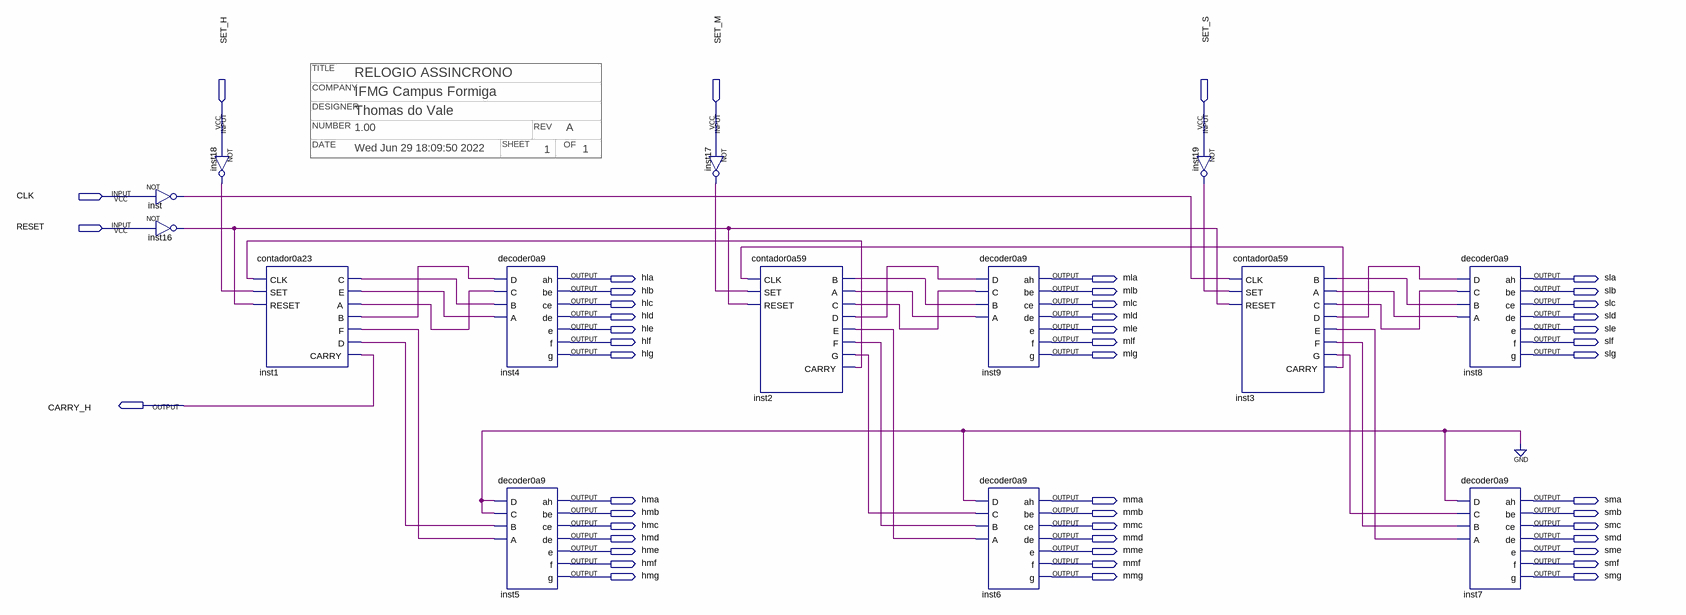
[diagram p0: schematic sheet]
// Quartus schematic tentativa2.bdf as structural Verilog: 14 symbols, 48 pins
// Title block: COMPANY: IFMG Campus Formiga; DATE: Wed Jun 29 18:09:50 2022; DESIGNER: Thomas do Vale; NUMBER: 1.00; OF: 1; REV: A; SHEET: 1; TITLE: RELOGIO ASSINCRONO
module tentativa2 (
  input  SET_H,
  input  SET_M,
  input  SET_S,
  input  CLK,
  input  RESET,
  output hla,
  output mla,
  output sla,
  output hlb,
  output mlb,
  output slb,
  output hlc,
  output mlc,
  output slc,
  output hld,
  output mld,
  output sld,
  output hle,
  output mle,
  output sle,
  output hlf,
  output mlf,
  output slf,
  output hlg,
  output mlg,
  output slg,
  output CARRY_H,
  output hma,
  output mma,
  output sma,
  output hmb,
  output mmb,
  output smb,
  output hmc,
  output mmc,
  output smc,
  output hmd,
  output mmd,
  output smd,
  output hme,
  output mme,
  output sme,
  output hmf,
  output mmf,
  output smf,
  output hmg,
  output mmg,
  output smg
);

  wire inst1_a, inst1_b, inst1_c, inst1_d, inst1_e, inst1_f, inst2_a, inst2_b, inst2_c, inst2_carry, inst2_d,
       inst2_e, inst2_f, inst2_g, inst3_a, inst3_b, inst3_c, inst3_carry, inst3_d, inst3_e, inst3_f, inst3_g,
       inst16_out, inst17_out, inst18_out, inst19_out, inst_out;

  not inst (inst_out, CLK);
  not inst16 (inst16_out, RESET);
  not inst18 (inst18_out, SET_H);
  contador0a23 inst1 (
    .CLK(inst2_carry), .SET(inst18_out), .RESET(inst16_out), .C(inst1_c), .E(inst1_e), .A(inst1_a),
    .B(inst1_b), .F(inst1_f), .D(inst1_d), .CARRY(CARRY_H));
  decoder0a9 inst4 (
    .D(inst1_b), .C(inst1_a), .B(inst1_c), .A(inst1_e), .ah(hla), .be(hlb), .ce(hlc), .de(hld), .e(hle),
    .f(hlf), .g(hlg));
  decoder0a9 inst5 (
    .D(1'b0), .C(1'b0), .B(inst1_d), .A(inst1_f), .ah(hma), .be(hmb), .ce(hmc), .de(hmd), .e(hme), .f(hmf),
    .g(hmg));
  not inst17 (inst17_out, SET_M);
  contador0a59 inst2 (
    .CLK(inst3_carry), .SET(inst17_out), .RESET(inst16_out), .B(inst2_b), .A(inst2_a), .C(inst2_c),
    .D(inst2_d), .E(inst2_e), .F(inst2_f), .G(inst2_g), .CARRY(inst2_carry));
  decoder0a9 inst9 (
    .D(inst2_d), .C(inst2_c), .B(inst2_b), .A(inst2_a), .ah(mla), .be(mlb), .ce(mlc), .de(mld), .e(mle),
    .f(mlf), .g(mlg));
  decoder0a9 inst6 (
    .D(1'b0), .C(inst2_g), .B(inst2_f), .A(inst2_e), .ah(mma), .be(mmb), .ce(mmc), .de(mmd), .e(mme),
    .f(mmf), .g(mmg));
  not inst19 (inst19_out, SET_S);
  contador0a59 inst3 (
    .CLK(inst_out), .SET(inst19_out), .RESET(inst16_out), .B(inst3_b), .A(inst3_a), .C(inst3_c), .D(inst3_d),
    .E(inst3_e), .F(inst3_f), .G(inst3_g), .CARRY(inst3_carry));
  decoder0a9 inst8 (
    .D(inst3_d), .C(inst3_c), .B(inst3_b), .A(inst3_a), .ah(sla), .be(slb), .ce(slc), .de(sld), .e(sle),
    .f(slf), .g(slg));
  decoder0a9 inst7 (
    .D(1'b0), .C(inst3_g), .B(inst3_f), .A(inst3_e), .ah(sma), .be(smb), .ce(smc), .de(smd), .e(sme),
    .f(smf), .g(smg));
endmodule
